# Altium schematic sheet power-v5v5.SchDoc: Power 5.5V
size Letter; CheckedBy: J. Brinton; CompanyName: Signal Laboratories, Inc.; DrawnBy: J. Brinton; Engineer: J. Brinton; Address1: 3479 Edison Way; Address2: Menlo Park CA 94025; Address3: +1 (877) 778-8435; Address4: siglabs.com; Revision: 3; SheetNumber: 2; SheetTotal: 7
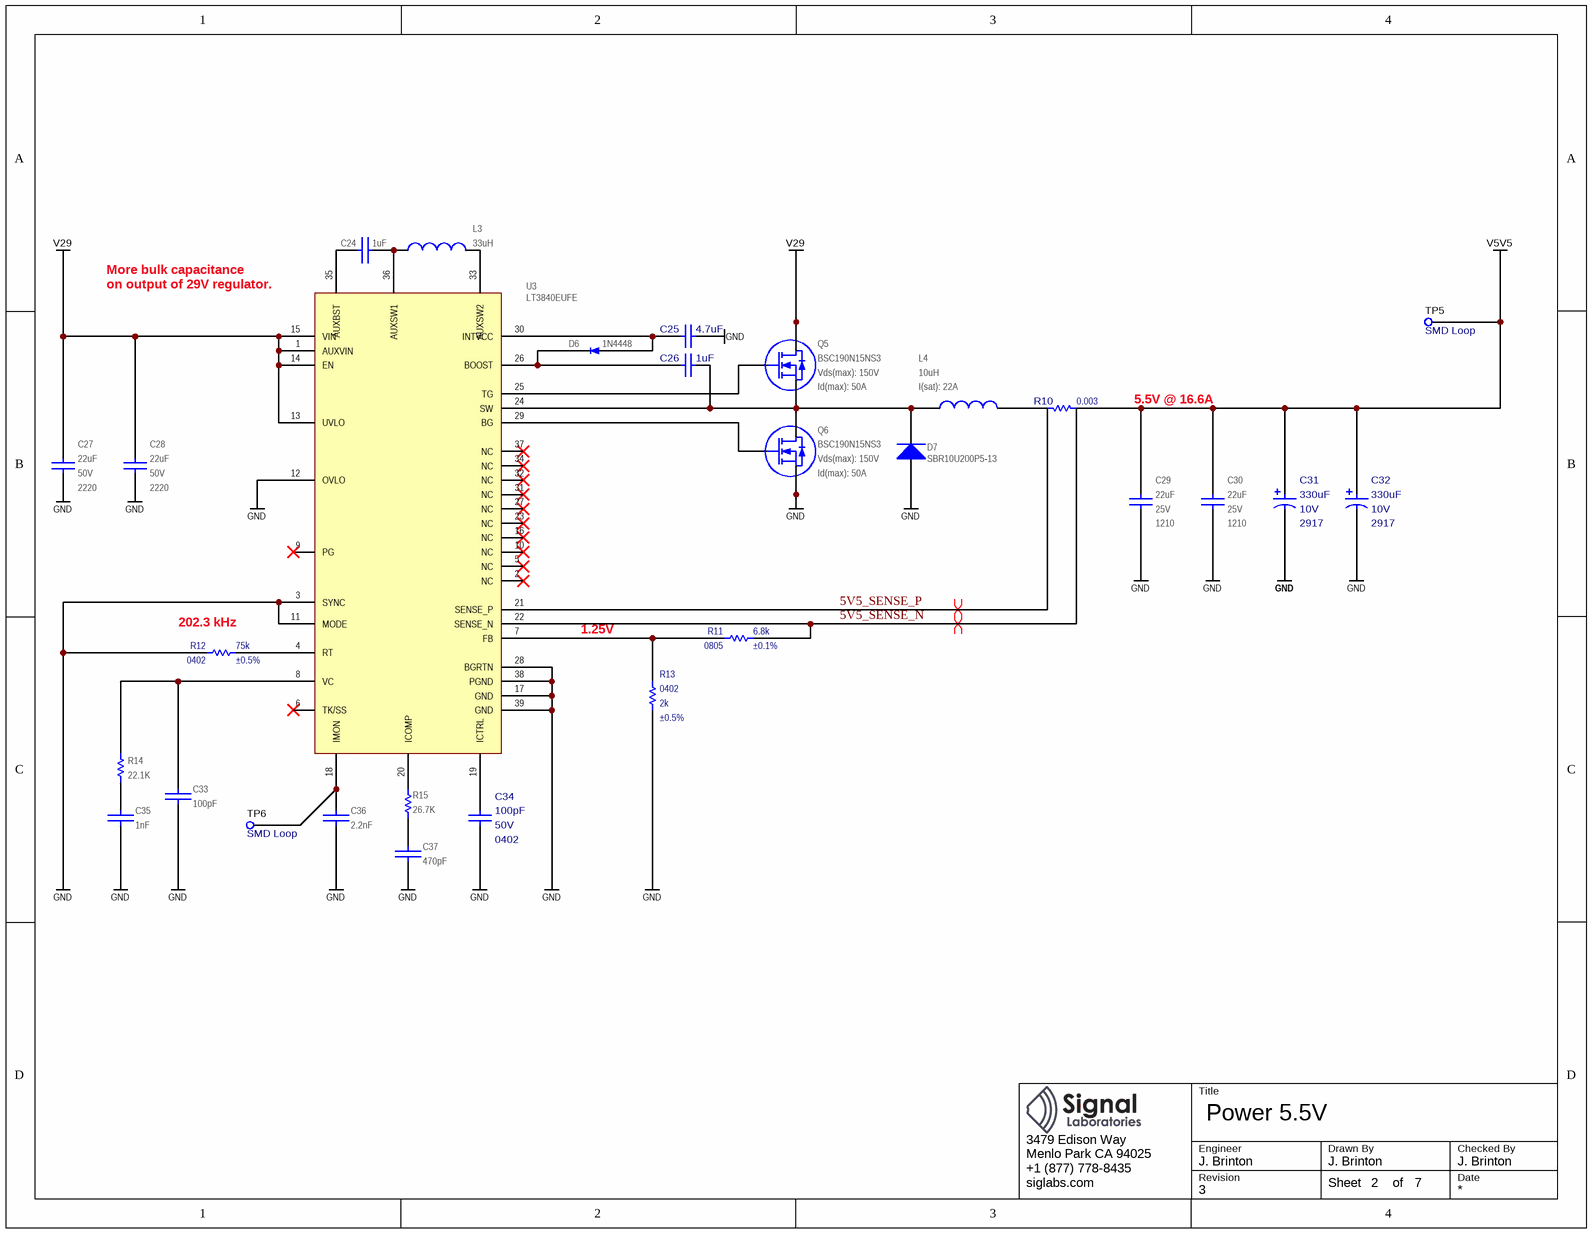
[diagram p0: power-v5v5.SchDoc]

## Parts
C24  value 1uF  [CAPC100X50X55L25N]  (hidden comment: GRM155R61A105KE15)
C25  value 4.7uF  [CAPC160X80X90L20NA]  (hidden comment: CL10A475KA8NQNC)
C26  value 1uF  [CAPC100X50X55L25N]  (hidden comment: GRM155R61A105KE15)
C27  value 22uF  Voltage: 50V  Package: 2220  [CAPC600X500X500L160N]  (hidden comment: CKG57NX7S1H226M500JJ)
C28  value 22uF  Voltage: 50V  Package: 2220  [CAPC600X500X500L160N]  (hidden comment: CKG57NX7S1H226M500JJ)
C29  value 22uF  Voltage: 25V  Package: 1210  [CAPC320X250X270L50N]  (hidden comment: GRM32ER71E226KE15)
C30  value 22uF  Voltage: 25V  Package: 1210  [CAPC320X250X270L50N]  (hidden comment: GRM32ER71E226KE15)
C31  value 330uF  Package: 2917  Voltage: 10V  [CAPPM730X435X310L135X240N]  (hidden comment: TPSE337K010R0050)
C32  value 330uF  Package: 2917  Voltage: 10V  [CAPPM730X435X310L135X240N]  (hidden comment: TPSE337K010R0050)
C33  value 100pF  [CAPC100X50X55L25N]  (hidden comment: GRM1555C1H101FA01D)
C34  value 100pF  Package: 0402  Voltage: 50V  [CAPC100X50X55L25N]  (hidden comment: VJ0402A101KXA)
C35  value 1nF  [CAPC100X50X55L25N]  (hidden comment: GRM1555C1H102JA01)
C36  value 2.2nF  [CAPC100X50X55L25N]  (hidden comment: C0402C222J3GACTU)
C37  value 470pF  [CAPC100X50X55L25N]  (hidden comment: GRM155R71H471JA01)
D6  Alternative P/N: 1N4448  [SOD323]  (hidden comment: 1N4448HWS-7-F)
D7  SBR10U200P5-13  [DIODES_POWERDI5]
L3  value 33uH  [ME3220]  (hidden comment: ME3220-333KL)
L4  value 10uH  I(sat): 22A  [HCM1A1707]  (hidden comment: PA4344.103ANLT)
Q5  BSC190N15NS3  Vds(max): 150V  Id(max): 50A  [TDSON-8]
Q6  BSC190N15NS3  Vds(max): 150V  Id(max): 50A  [TDSON-8]
R10  value 0.003  [KRL3216T4]  (hidden comment: KRL3216T4A-M-R003-F)
R11  value 6.8k  Tolerance: ±0.1%  Package: 0805  [RESC2012X70N]  (hidden comment: RG2012P-682-B-T5)
R12  value 75k  Tolerance: ±0.5%  Package: 0402  [RESC1005X40N]  (hidden comment: RR0510P-753-D)
R13  value 2k  Tolerance: ±0.5%  Package: 0402  [RESC1005X40N]  (hidden comment: RR0510P-202-D)
R14  value 22.1K  [RESC1005X40N]  (hidden comment: ERJ-2RKF2212X)
R15  value 26.7K  [RESC1005X40N]  (hidden comment: ERJ-2RKF2672X)
TP5  Notes: SMD Loop  [5015]  (hidden comment: 5015)
TP6  Notes: SMD Loop  [5015]  (hidden comment: 5015)
U3  LT3840EUFE  [QFN39P40_600X400X80L40X20T465X265N]

## Nets
GND: C25.2 C27.1 C28.1 C29.1 C30.1 C31.2 C32.2 C33.1 C34.2 C35.2 C36.2 C37.1 D7.A Q6.1(S) Q6.2(S) Q6.3(S) R12.2 R13.1 U3.3(SYNC) U3.11(MODE) U3.12(OVLO) U3.17(GND) U3.28(BGRTN) U3.38(PGND) U3.39(GND)
V5V5: C29.2 C30.2 C31.1 C32.1 R10.2 TP5.1
V29: C27.2 C28.2 Q5.5(D) Q5.6(D) Q5.7(D) Q5.8(D) Q5.9(D) U3.1(AUXVIN) U3.13(UVLO) U3.14(EN) U3.15(VIN)
5V5_SENSE_N: R10.4 R11.1 U3.22(SENSE_N)
5V5_SENSE_P: R10.3 U3.21(SENSE_P)
NetC24_1: C24.1 L3.1 U3.36(AUXSW1)
NetC24_2: C24.2 U3.35(AUXBST)
NetC25_1: C25.1 D6.A U3.30(INTVCC)
NetC26_1: C26.1 D6.K U3.26(BOOST)
NetC26_2: C26.2 D7.K L4.1 Q5.1(S) Q5.2(S) Q5.3(S) Q6.5(D) Q6.6(D) Q6.7(D) Q6.8(D) Q6.9(D) U3.24(SW)
NetC33_2: C33.2 R14.2 U3.8(VC)
NetC34_1: C34.1 U3.19(ICTRL)
NetC35_1: C35.1 R14.1
NetC36_1: C36.1 TP6.1 U3.18(IMON)
NetC37_2: C37.2 R15.2
NetL3_2: L3.2 U3.33(AUXSW2)
NetL4_2: L4.2 R10.1
NetQ5_4: Q5.4(G) U3.25(TG)
NetQ6_4: Q6.4(G) U3.29(BG)
NetR11_2: R11.2 R13.2 U3.7(FB)
NetR12_1: R12.1 U3.4(RT)
NetR15_1: R15.1 U3.20(ICOMP)

Not connected (* = marked no-connect by the designer): U3 2(NC)* 5(NC)* 6(TK/SS)* 9(PG)* 10(NC)* 16(NC)* 23(NC)* 27(NC)* 31(NC)* 32(NC)* 34(NC)* 37(NC)*

## Layout directives
differential pair: 5V5_SENSE_N, 5V5_SENSE_P

## Notes on the sheet
- More bulk capacitance
- (near U3) on output of 29V regulator.
- 5.5V @ 16.6A
- (near R12) 202.3 kHz
- 1.25V
- Title
- Engineer
- Revision
- Drawn By
- Checked By
- Date
- Sheet
- of

## Library data of the parts
C24 = CAP: Ceramic Capacitor 1uF ±10% 10V X5R 0402; Manufacturer: Murata; Tr: -55:125; Manufacturer P/N: GRM155R61A105KE15; Package: 0402; Tolerance: ±10%; Voltage: 10V
C25 = TMK212B7475KG: Ceramic Capacitor 4.7uF ±10% 25V X5R 0603; Manufacturer: Samsung; Tr: -55:85; Manufacturer P/N: CL10A475KA8NQNC; Tolerance: ±10%; Package: 0603; Voltage: 25V
C26 = UMK212B7105KG: Ceramic Capacitor 1uF ±10% 10V X5R 0402; Manufacturer: Murata; Voltage: 50V; Manufacturer P/N: GRM155R61A105KE15; Tolerance: ±10%; Tr: *; Package: 0402
C27 C28 = CAP: Ceramic Capacitor 22uF ±20% 50V X7S Stacked; Manufacturer: TDK; Tr: -55:125; Manufacturer P/N: CKG57NX7S1H226M500JJ; Tolerance: ±20%
C29 C30 = CAP: Ceramic Capacitor 22uF ±10% 25V X7R 1210; Manufacturer: Murata; Tr: -55:125; Manufacturer P/N: GRM32ER71E226KE15; Tolerance: ±10%
C31 C32 = CAP_POL: Tantalum Capacitor 330uF ±10% 10V 2917; Manufacturer: AVX; Tr: -55:125; Manufacturer P/N: TPSE337K010R0050; Tolerance: ±10%
C33 = CAP: Ceramic Capacitor 100pF ±1% 50V NP0 0402; Manufacturer: Murata; Tr: -55:125; Manufacturer P/N: GRM1555C1H101FA01D; Voltage: 50V; Package: 0402; Tolerance: ±1%
C34 = VJ0402A101KXA: Ceramic Capacitor 100pF ±10% 50V C0G 0402; Manufacturer: Vishay; Tr: -55:150; Manufacturer P/N: VJ0402A101KXA; Tolerance: ±10%
C35 = CAP: Ceramic Capacitor 1nF ±5% 50V NP0 0402; Manufacturer: Murata; Tr: -55:125; Manufacturer P/N: GRM1555C1H102JA01; Voltage: 50V; Package: 0402; Tolerance: ±5%
C36 = CAP: Ceramic Capacitor 2.2nF ±5% 25V NP0 0402; Manufacturer: Kemet; Tr: -55:125; Manufacturer P/N: C0402C222J3GACTU; Package: 0402; Tolerance: ±5%; Voltage: 25V
C37 = CAP: Ceramic Capacitor 470pF ±5% 50V X7R 0402; Manufacturer: Murata; Tr: -55:125; Manufacturer P/N: GRM155R71H471JA01; Voltage: 50V; Package: 0402; Tolerance: ±5%
D6 = 1N4448HWS-7-F: Schottky Diode 80V 250mA SOD323; Manufacturer: Diodes Inc; Manufacturer P/N: 1N4448HWS-7-F; Package: SOD323
D7 = PDS5100H: Schottky Diode 200V 10A SMD; Manufacturer: Diodes Inc; Manufacturer P/N: SBR10U200P5-13; Current: 10A; Reverse Voltage (max): 200V; Package: PowerDi-5
L3 = COIL: Inductor 33uH ±10% 500mA SMD; Manufacturer: Coilcraft; Tr: -40:85; Manufacturer P/N: ME3220-333KL; I(sat): 500mA; Package: *; Tolerance: ±10%
L4 = COIL: Inductor 10uH, 22A(sat), SMD; Manufacturer: Pulse Electronics Power; Notes: Same size inductor as HCM1A1707; Manufacturer P/N: PA4344.103ANLT
Q5 Q6 = BSC190N15NS3: MOSFET N-Channel Enhancement Mode; Manufacturer: Infineon; Rds(on): 19mOhm; Manufacturer P/N: BSC190N15NS3
R10 = KRL3216T4A-M-R009-F: Current Sense Resistor 3 mOhms +/-1% SMD 4-Terminal; Manufacturer: Susumu; Tolerance: ±1%; Tr: -55:+155; Manufacturer P/N: KRL3216T4A-M-R003-F
R11 = RES: Thin Film Resistor 6.8k +/-0.1% SMD 0805; Manufacturer: Susumu; Tr: -55:155; Tcr: *; Manufacturer P/N: RG2012P-682-B-T5; Alternatives: *; Voltage: *; Power: *
R12 = RES: Thin Film Resistor 75k +/-0.5% SMD 0402; Manufacturer: Susumu; Tr: -55:155; Tcr: *; Manufacturer P/N: RR0510P-753-D; Alternatives: *; Voltage: *; Power: *
R13 = RES: Thin Film Resistor 2k +/-0.5% SMD 0402; Manufacturer: Susumu; Tr: -55:155; Tcr: *; Manufacturer P/N: RR0510P-202-D; Alternatives: *; Voltage: *; Power: *
R14 = RES 0402: Thick Film Resistor 22.1k ±1% 0402; Manufacturer: Panasonic; Tr: -55:155; Package: 0402; Manufacturer P/N: ERJ-2RKF2212X; Tolerance: ±1%
R15 = RES 0402: Thick Film Resistor 26.7k ±1% 0402; Manufacturer: Panasonic; Tr: -55:155; Package: 0402; Manufacturer P/N: ERJ-2RKF2672X; Tolerance: ±1%
TP5 TP6 = TEST_POINT_SMD_50: Test Point SMD; Manufacturer: Keystone; Manufacturer P/N: 5015
U3 = LT3840EUFE: Synchronous Regulator Controller; Manufacturer: Linear Technology; Alternative P/N: LT3840IUFE; Manufacturer P/N: LT3840EUFE